# EAGLE design EPIC_breakout (EAGLE 7.4.0)
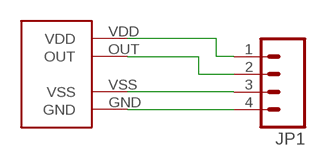
[diagram p0: schematic, sheet 1]

## Parts
JP1  M041.27MM  [1X04-1.27MM]
U$1  EPIC  [EPIC_QFN]

## Nets
N$1: JP1.4 U$1.GND
N$2: JP1.3 U$1.VSS
N$3: JP1.2 U$1.OUT
N$4: JP1.1 U$1.VDD

## Library data of the parts
JP1 = SparkFun-Connectors:M04: Header 4 Standard 4-pin 0.1" header. Use with straight break away headers (SKU : PRT-00116), right angle break away headers (PRT-00553), swiss pins (PRT-00743), machine pins (PRT-00117), and female headers (PRT-00115). Molex polarized connector foot print use with SKU : PRT-08231 with associated crimp pins and housings. 1MM SMD Version SKU: PRT-10208
U$1 = EPIC:EPIC

## Board
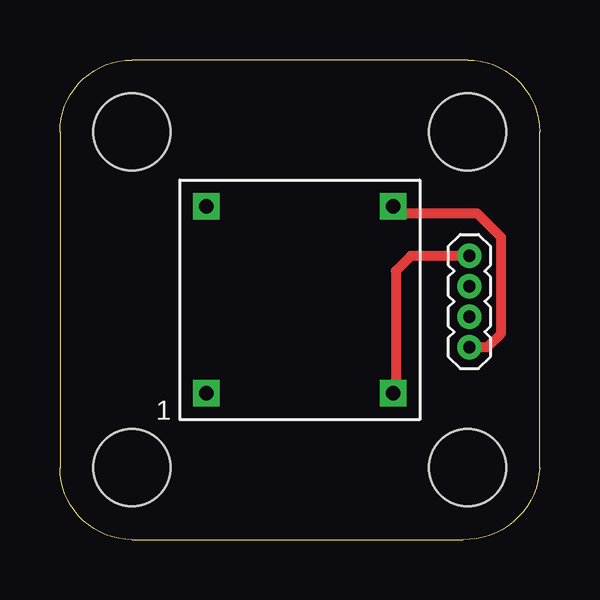
[diagram p1: board, top side]
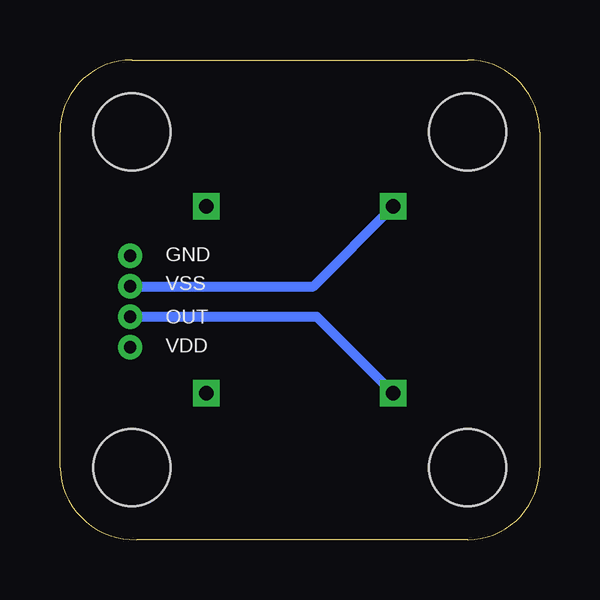
[diagram p2: board, bottom side, seen from below]

Size 20 x 20 mm. Coordinates in mm from the lower left corner, seen from the top.
Outline: 3,0 16.8,0 arc90 20,3 20,17 arc90 17,20 3,20 arc90 0,17 0,3 arc90 3,0
Copper layers (1*16): Top 0.035mm / dielectric 1.5mm / Bottom 0.035mm
Design rules "default": minimum track width 10mil, minimum drill 24mil, track to track 8mil, track to pad 8mil, pad to pad 8mil, via to via 8mil, smd to smd 8mil, copper to edge 40mil, drill to drill 8mil, minimum pad ring 10mil, minimum via ring 8mil, stop-mask expansion 4mil, vias tented up to drill 0mil, thermal gap 10mil
Holes 3.2 mm at 3,3 17,3 17,17 3,17

### Footprints (pad centres in the part's own frame; a part is rotated, then mirrored left to right if it is on the bottom)
1X04-1.27MM = drill 0.508 pad 1: 1 0,0; 2 1.27,0; 3 2.54,0; 4 3.81,0
EPIC_QFN = drill 0.6 pad 1.016 square: GND 8.9,1.1; OUT 1.1,1.1; VDD 8.9,8.9; VSS 1.1,8.9

### Placement (x,y rotation side)
JP1  17.07,8.02 90 top
U$1  5,5 0 top

### Tracks (layer width: path | path; a pad name or v marks a point on that pad's centre or on a via)
N$1
  Top 0.406: JP1.4 14.63,11.83 14,11.2 14,6.2 U$1.GND
N$2
  Bottom 0.406: JP1.3 9.44,10.56 U$1.VSS
N$3
  Bottom 0.406: JP1.2 9.29,9.29 U$1.OUT
N$4
  Top 0.406: JP1.1 17.82,8.02 18.4,8.6 18.4,12.6 17.4,13.6 14.2,13.6 U$1.VDD

### Text on the board
tPlace: 1
bPlace: GND | VSS | OUT | VDD